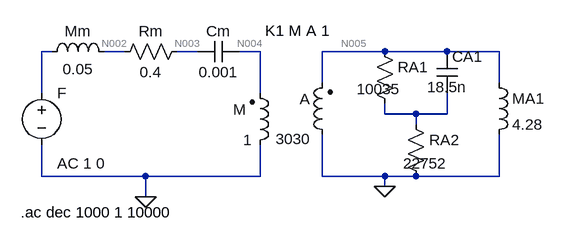
[diagram p0: schematic EA_EX6_PistaoBaffleInfinito.asc]
EA_EX6_PistaoBaffleInfinito.asc, the LTspice schematic file:
Version 4
SHEET 1 880 680
WIRE -64 80 -80 80
WIRE 48 80 16 80
WIRE 160 80 128 80
WIRE 256 80 224 80
WIRE 448 80 352 80
WIRE 544 80 448 80
WIRE 624 80 544 80
WIRE 352 128 352 80
WIRE 624 128 624 80
WIRE -80 144 -80 80
WIRE 256 144 256 80
WIRE 448 176 448 160
WIRE 496 176 448 176
WIRE 544 176 544 144
WIRE 544 176 496 176
WIRE 496 192 496 176
WIRE -80 272 -80 224
WIRE 80 272 -80 272
WIRE 256 272 256 224
WIRE 256 272 80 272
WIRE 352 272 352 208
WIRE 448 272 352 272
WIRE 496 272 448 272
WIRE 624 272 624 208
WIRE 624 272 496 272
WIRE 448 288 448 272
WIRE 80 304 80 272
FLAG 448 288 0
FLAG 80 304 0
SYMBOL ind -80 96 R270
WINDOW 0 32 56 VTop 2
WINDOW 3 5 56 VBottom 2
SYMATTR InstName Mm
SYMATTR Value 0.05
SYMBOL res 144 64 R90
WINDOW 0 0 56 VBottom 2
WINDOW 3 32 56 VTop 2
SYMATTR InstName Rm
SYMATTR Value 0.4
SYMBOL cap 224 64 R90
WINDOW 0 0 32 VBottom 2
WINDOW 3 32 32 VTop 2
SYMATTR InstName Cm
SYMATTR Value 0.001
SYMBOL ind2 240 240 M180
WINDOW 0 -25 71 Left 2
WINDOW 3 -10 24 Left 2
SYMATTR InstName M
SYMATTR Value 1
SYMBOL ind2 368 224 R180
WINDOW 0 35 71 Left 2
WINDOW 3 34 9 Left 2
SYMATTR InstName A
SYMATTR Value 3030
SYMBOL res 432 64 R0
WINDOW 3 -27 74 Left 2
SYMATTR Value 10035
SYMATTR InstName RA1
SYMBOL res 480 176 R0
WINDOW 3 -4 76 Left 2
SYMATTR Value 22752
SYMATTR InstName RA2
SYMBOL cap 528 80 R0
WINDOW 3 -15 55 Left 2
SYMATTR Value 18.5n
SYMATTR InstName CA1
SYMBOL ind 608 112 R0
SYMATTR InstName MA1
SYMATTR Value 4.28
SYMBOL voltage -80 128 R0
WINDOW 123 24 124 Left 2
WINDOW 39 0 0 Left 0
SYMATTR Value2 AC 1 0
SYMATTR InstName F
SYMATTR Value ""
TEXT 264 48 Left 2 !K1 M A 1
TEXT -112 328 Left 2 !.ac dec 1000 1 10000

The netlist it stands for:
* EA_EX6_PistaoBaffleInfinito.asc
L§Mm N001 N002 0.05
Rm N003 N002 0.4
Cm N004 N003 0.001
L§M 0 N004 1
L§A 0 N005 3030
RA1 N005 N006 10035
RA2 N006 0 22752
CA1 N005 N006 18.5n
L§MA1 N005 0 4.28
V§F N001 0 AC 1 0
K1 M A 1
.ac dec 1000 1 10000
.backanno
.end

* Results of the author's LTspice run, read from the files saved beside the schematic
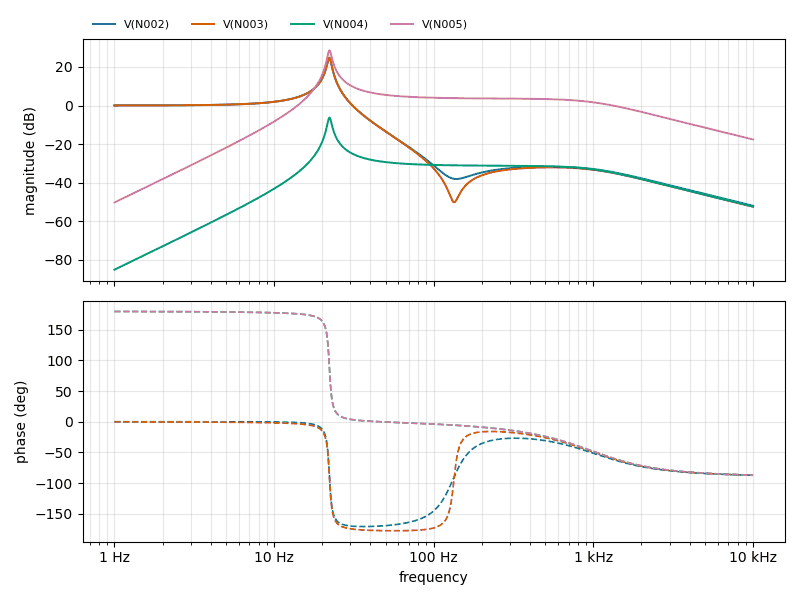
[diagram p1: AC Analysis of EA_EX6_PistaoBaffleInfinito.asc, plotted from the saved traces]
* AC Analysis, 1 run:
*   V(N002): 0.02 dB at 1 Hz, -51.95 dB at 10 kHz, peak 24.75 dB at 22.18 Hz, 3 dB below the peak at 21.54 Hz and 22.8 Hz
*   V(N003): 0.02 dB at 1 Hz, -52.40 dB at 10 kHz, peak 24.73 dB at 22.18 Hz, 3 dB below the peak at 21.54 Hz and 22.79 Hz
*   V(N004): -85.07 dB at 1 Hz, -52.40 dB at 10 kHz, peak -6.26 dB at 22.23 Hz, 3 dB below the peak at 21.61 Hz and 22.87 Hz
*   V(N005): -50.25 dB at 1 Hz, -17.59 dB at 10 kHz, peak 28.55 dB at 22.23 Hz, 3 dB below the peak at 21.61 Hz and 22.87 Hz